# EAGLE design MBC5_1-3_multi (EAGLE 9.6.2)
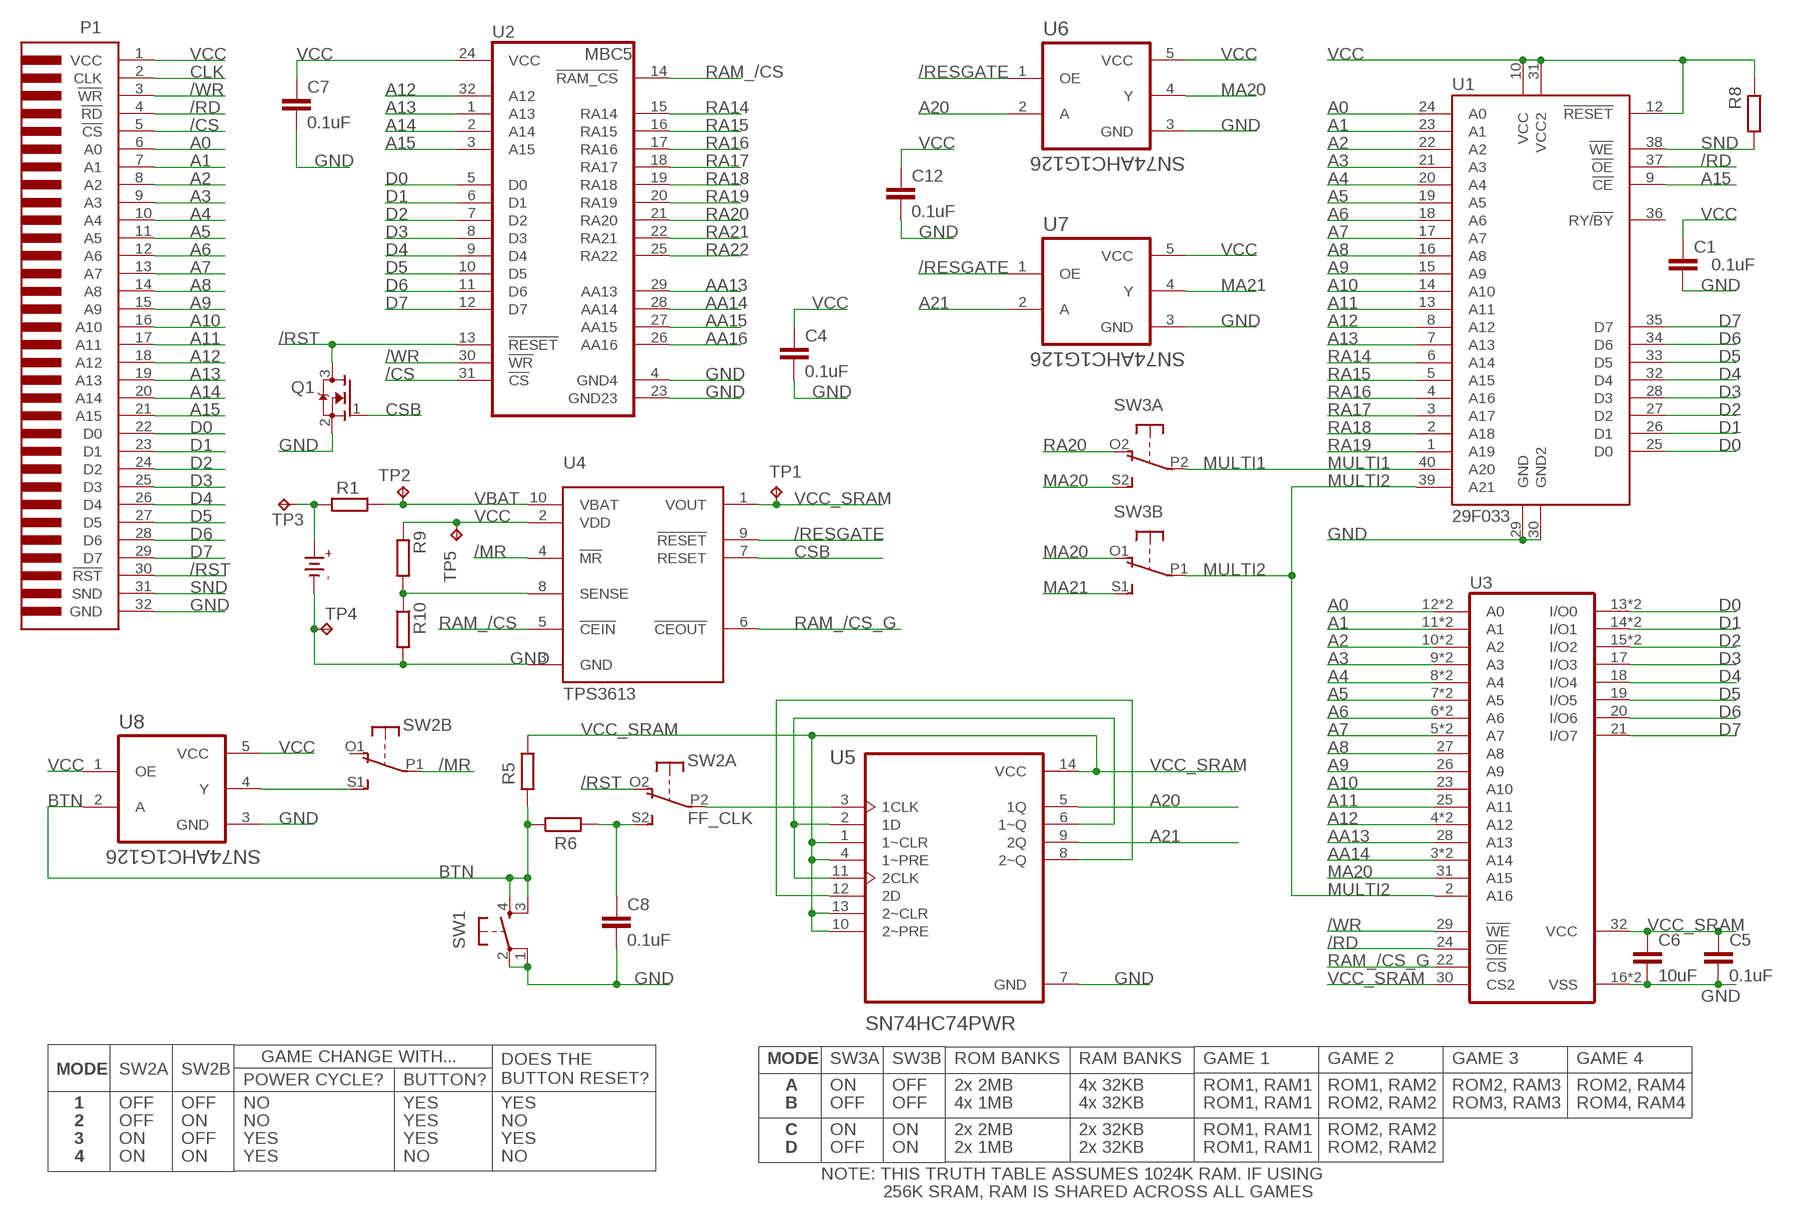
[diagram p0: schematic, sheet 1]

## Parts
C1  0.1uF  C-EUC0603  [C0603]
C4  0.1uF  C-EUC0603  [C0603]
C5  0.1uF  C-EUC0603  [C0603]
C6  10uF  C-EUC0603  [C0603]
C7  0.1uF  C-EUC0603  [C0603]
C8  0.1uF  C-EUC0603  [C0603]
C12  0.1uF  C-EUC0603  [C0603]
P1  GBC_CARTTAB  [GBC_CART_TABBED]
Q1  2N7002  MOSFET-NREFLOW  [SOT23]
R1  RR0603  [R0603]
R5  RR0603  [R0603]
R6  RR0603  [R0603]
R8  RR0603  [R0603]
R9  RR0603  [R0603]
R10  RR0603  [R0603]
SW1  SPST_TACT-KMR2  [KMR2]
SW2  SPDT-2S  [CAS-D20A]
SW3  SPDT-2S  [CAS-D20A]
TP1  TPB1,27  [B1,27]
TP2  TPB1,27  [B1,27]
TP3  TPB1,27  [B1,27]
TP4  TPB1,27  [B1,27]
TP5  TPB1,27  [B1,27]
U1  29F033  [TSOP-40]
U2  MBC5  [QFP-32]
U3  1008_62256_SRAM  [SOP-32L]
U4  TPS3613  [MSOP-10]
U5  SN74HC74PWR  [SOP65P640X120-14N]
U6  SN74AHC1G126  [SC70]
U7  SN74AHC1G126  [SC70]
U8  SN74AHC1G126  [SC70]
U$7  CR2025  [CR2025]

## Nets
/CS: P1.5(!CS) U2.31(!CS)
/MR: SW2.P1(A:P) U4.4(!MR)
/RD: P1.4(!RD) U1.37(!OE) U3.24(!OE)
/RESGATE: U4.9(!RESET) U6.1(OE) U7.1(OE)
/RST: P1.30(!RST) Q1.3(D) SW2.O2(B:O) U2.13(!RESET)
/WR: P1.3(!WR) U2.30(!WR) U3.29(!WE)
A0: P1.6(A0) U1.24(A0) U3.12(A0) U3.L12(A0)
A1: P1.7(A1) U1.23(A1) U3.11(A1) U3.L11(A1)
A2: P1.8(A2) U1.22(A2) U3.10(A2) U3.L10(A2)
A3: P1.9(A3) U1.21(A3) U3.9(A3) U3.L9(A3)
A4: P1.10(A4) U1.20(A4) U3.8(A4) U3.L8(A4)
A5: P1.11(A5) U1.19(A5) U3.7(A5) U3.L7(A5)
A6: P1.12(A6) U1.18(A6) U3.6(A6) U3.L6(A6)
A7: P1.13(A7) U1.17(A7) U3.5(A7) U3.L5(A7)
A8: P1.14(A8) U1.16(A8) U3.27(A8)
A9: P1.15(A9) U1.15(A9) U3.26(A9)
A10: P1.16(A10) U1.14(A10) U3.23(A10)
A11: P1.17(A11) U1.13(A11) U3.25(A11)
A12: P1.18(A12) U1.8(A12) U2.32(A12) U3.4(A12) U3.L4(A12)
A13: P1.19(A13) U1.7(A13) U2.1(A13)
A14: P1.20(A14) U2.2(A14)
A15: P1.21(A15) U1.9(!CE) U2.3(A15)
A20: U5.5(1Q) U6.2(A)
A21: U5.9(2Q) U7.2(A)
AA13: U2.29(AA13) U3.28(A13)
AA14: U2.28(AA14) U3.3(A14) U3.L3(A14)
AA15: U2.27(AA15)
AA16: U2.26(AA16)
BTN: R5.2 R6.1 SW1.3(S1) SW1.4(S) U8.2(A)
CLK: P1.2(CLK)
CSB: Q1.1(G) U4.7(RESET)
D0: P1.22(D0) U1.25(D0) U2.5(D0) U3.13(I/O0) U3.L13(I/O0)
D1: P1.23(D1) U1.26(D1) U2.6(D1) U3.14(I/O1) U3.L14(I/O1)
D2: P1.24(D2) U1.27(D2) U2.7(D2) U3.15(I/O2) U3.L15(I/O2)
D3: P1.25(D3) U1.28(D3) U2.8(D3) U3.17(I/O3)
D4: P1.26(D4) U1.32(D4) U2.9(D4) U3.18(I/O4)
D5: P1.27(D5) U1.33(D5) U2.10(D5) U3.19(I/O5)
D6: P1.28(D6) U1.34(D6) U2.11(D6) U3.20(I/O6)
D7: P1.29(D7) U1.35(D7) U2.12(D7) U3.21(I/O7)
FF_CLK: SW2.P2(B:P) U5.3(1CLK)
GND [GND]: C1.2 C4.2 C5.2 C6.2 C7.2 C8.2 C12.2 P1.32(GND) Q1.2(S) R10.2 SW1.1 SW1.2(P) TP4.TP U1.29(GND) U1.30(GND2) U2.4(GND4) U2.23(GND23) U3.16(VSS) U3.L16(VSS) U4.3(GND) U5.7(GND) U6.3(GND) U7.3(GND) U8.3(GND) U$7.-
MA20: SW3.O1(A:O) SW3.S2(B:S) U3.31(A15) U6.4(Y)
MA21: SW3.S1(A:S) U7.4(Y)
MULTI1: SW3.P2(B:P) U1.40(A20)
MULTI2: SW3.P1(A:P) U1.39(A21) U3.2(A16)
N$1: SW2.S1(A:S) U8.4(Y)
N$2: C8.1 R6.2 SW2.S2(B:S)
N$3 [VCC]: R1.2 TP3.TP U$7.+
N$4: U5.2(1D) U5.6(1~Q) U5.11(2CLK)
N$7: R9.2 R10.1 U4.8(SENSE)
N$14: U5.8(2~Q) U5.12(2D)
RA14: U1.6(A14) U2.15(RA14)
RA15: U1.5(A15) U2.16(RA15)
RA16: U1.4(A16) U2.17(RA16)
RA17: U1.3(A17) U2.18(RA17)
RA18: U1.2(A18) U2.19(RA18)
RA19: U1.1(A19) U2.20(RA19)
RA20: SW3.O2(B:O) U2.21(RA20)
RA21: U2.22(RA21)
RA22: U2.25(RA22)
RAM_/CS: U2.14(!RAM_CS) U4.5(!CEIN)
RAM_/CS_G: U3.22(!CS) U4.6(!CEOUT)
SND: P1.31(SND) R8.2 U1.38(!WE)
VBAT [VCC]: R1.1 TP2.TP U4.10(VBAT)
VCC [VCC]: C1.1 C4.1 C7.1 C12.1 P1.1(VCC) R8.1 R9.1 TP5.TP U1.10(VCC) U1.12(!RESET) U1.31(VCC2) U2.24(VCC) U4.2(VDD) U6.5(VCC) U7.5(VCC) U8.1(OE) U8.5(VCC)
VCC_SRAM [VCC]: C5.1 C6.1 R5.1 TP1.TP U3.30(CS2) U3.32(VCC) U4.1(VOUT) U5.1(1~CLR) U5.4(1~PRE) U5.10(2~PRE) U5.13(2~CLR) U5.14(VCC)
Unconnected: SW2.O1(A:O) U1.36(RY/!BY)

## Notes on the sheet
- GAME CHANGE WITH... | MODE | SW3A | SW3B | ROM BANKS | RAM BANKS | GAME 1 | GAME 2 | GAME 3 | GAME 4
- MODE | SW2A | SW2B
- DOES THE 
  BUTTON RESET?
- POWER CYCLE? | BUTTON?
- A | ON | OFF | 2x 2MB | 4x 32KB | ROM1, RAM1 | ROM1, RAM2 | ROM2, RAM3 | ROM2, RAM4
- 1 | OFF | OFF | NO | YES | YES | B | OFF | OFF | 4x 1MB | 4x 32KB | ROM1, RAM1 | ROM2, RAM2 | ROM3, RAM3 | ROM4, RAM4
- 2 | OFF | ON | NO | YES | NO
- C | ON | ON | 2x 2MB | 2x 32KB | ROM1, RAM1 | ROM2, RAM2
- 3 | ON | OFF | YES | YES | YES
- D | OFF | ON | 2x 1MB | 2x 32KB | ROM1, RAM1 | ROM2, RAM2
- 4 | ON | ON | YES | NO | NO
- NOTE: THIS TRUTH TABLE ASSUMES 1024K RAM. IF USING
- 256K SRAM, RAM IS SHARED ACROSS ALL GAMES

## Library data of the parts
C1 C4-C8 C12 = rcl:C-EU: CAPACITOR, European symbol; SPICEPREFIX: C
P1 = gameboylib:GBC_CART
Q1 = adafruit:MOSFET-N: N-Channel Mosfet 2N7002E - 60V 260mA SOT23 [Digikey: 2N7002ET1GOSTR-ND] - REEL BSH103 - 30V 850mA SOT23 [Digikey: 568-5013-1-ND]
R1 R5 R6 R8-R10 = eagle-ltspice:R: RESISTOR, European symbol; SPICEMODEL: NONE; SPICEPREFIX: R
SW1 = gameboylib:SPST_TACT: SMT 6mm switch, EVQQ2 series http://www.ladyada.net/library/eagle
SW2 SW3 = gameboylib:SPDT-2S
TP1-TP5 = testpad:TP: Test pad
U1 = gameboylib:29F033
U2 = gameboylib:MBC5: MBC5; OC_FARNELL: unknown; OC_NEWARK: unknown
U3 = gameboylib:1008_62256_SRAM
U4 = gameboylib:TPS3613
U5 = SN74HC74PWR:SN74HC74PWR: Check availability <https://pricing.snapeda.com/parts/SN74HC74PWR/Texas%20Instruments/view-part?ref=eda>; AVAILABILITY: In Stock; CHECK_PRICES: https://www.snapeda.com/parts/SN74HC74PWR/Texas+Instruments/view-part/?ref=eda; DESCRIPTION: Dual D-Type Positive-Edge-Triggered Flip-Flops With Clear and Preset; MF: Texas Instruments; MP: SN74HC74PWR; PACKAGE: TSSOP-14 Texas Instruments; PRICE: None; PURCHASE-URL: https://www.snapeda.com/api/url_track_click_mouser/?unipart_id=282074&manufacturer=Texas Instruments&part_name=SN74HC74PWR&search_term=sn74hc74; SNAPEDA_LINK: https://www.snapeda.com/parts/SN74HC74PWR/Texas+Instruments/view-part/?ref=snap
U6-U8 = gameboylib:SN74AHC1G126: Check availability <https://pricing.snapeda.com/parts/SN74AHC1G08DBVR/Texas%20Instruments/view-part?ref=eda>
U$7 = gameboylib:CR2025

## Net classes
1 VCC: width 0.203 mm
2 GND: width 0.203 mm

## Board
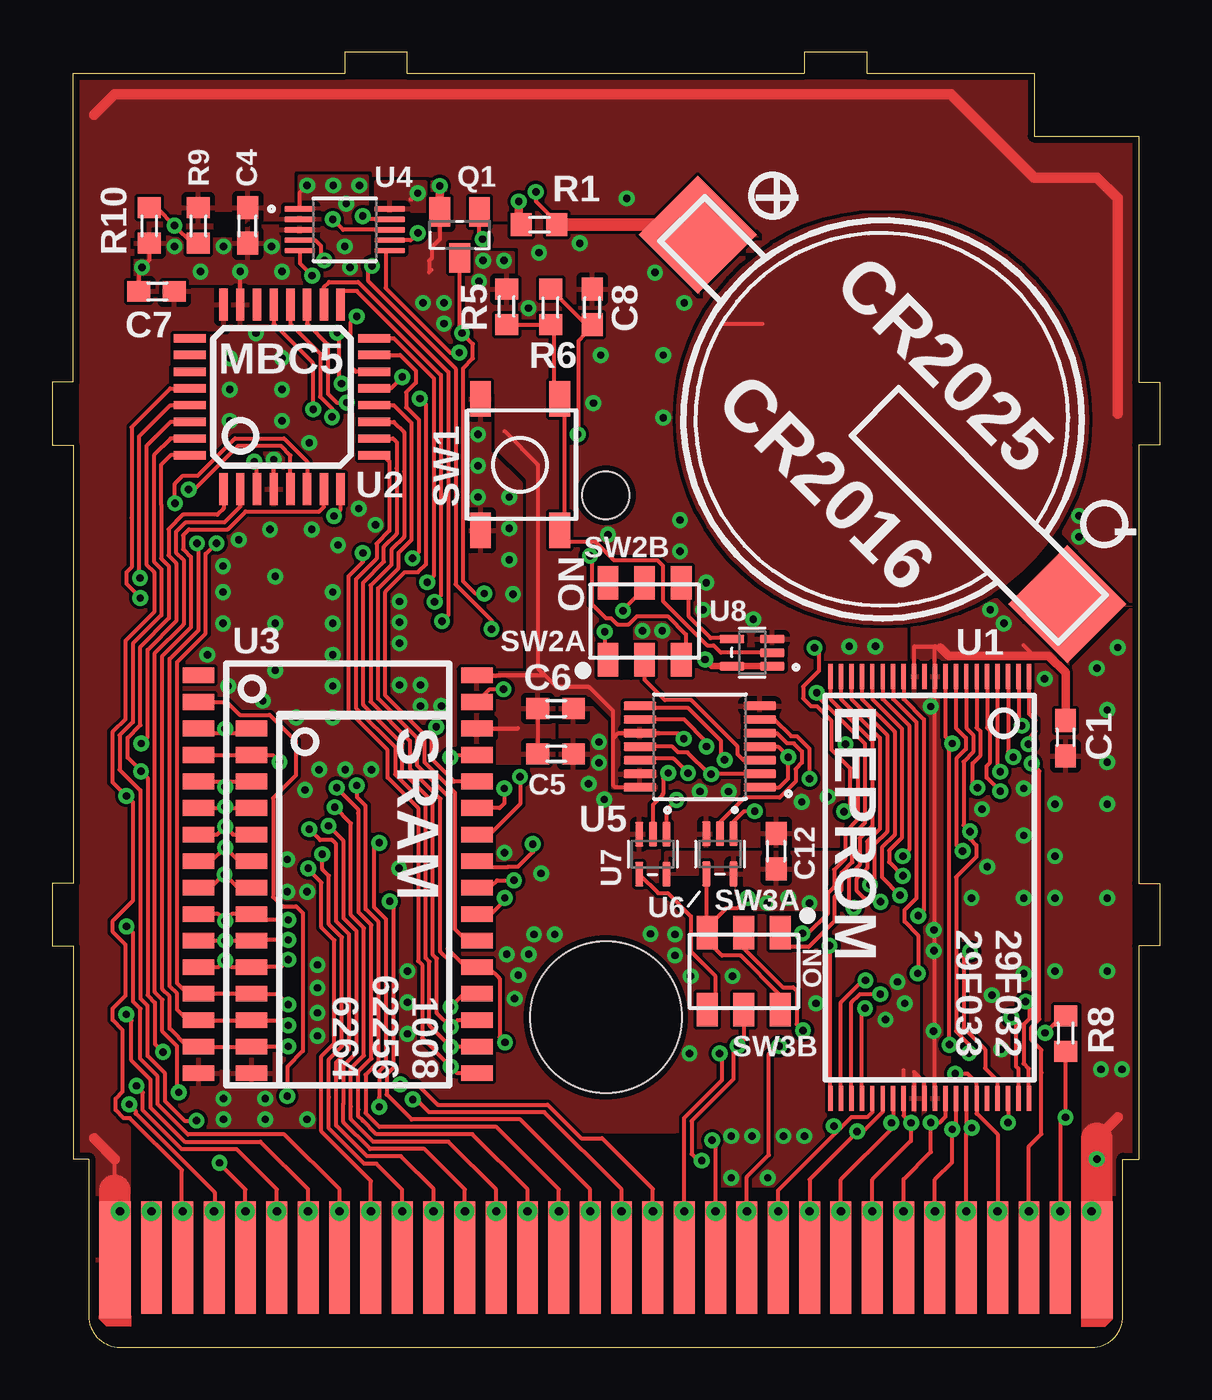
[diagram p1: board, top side]
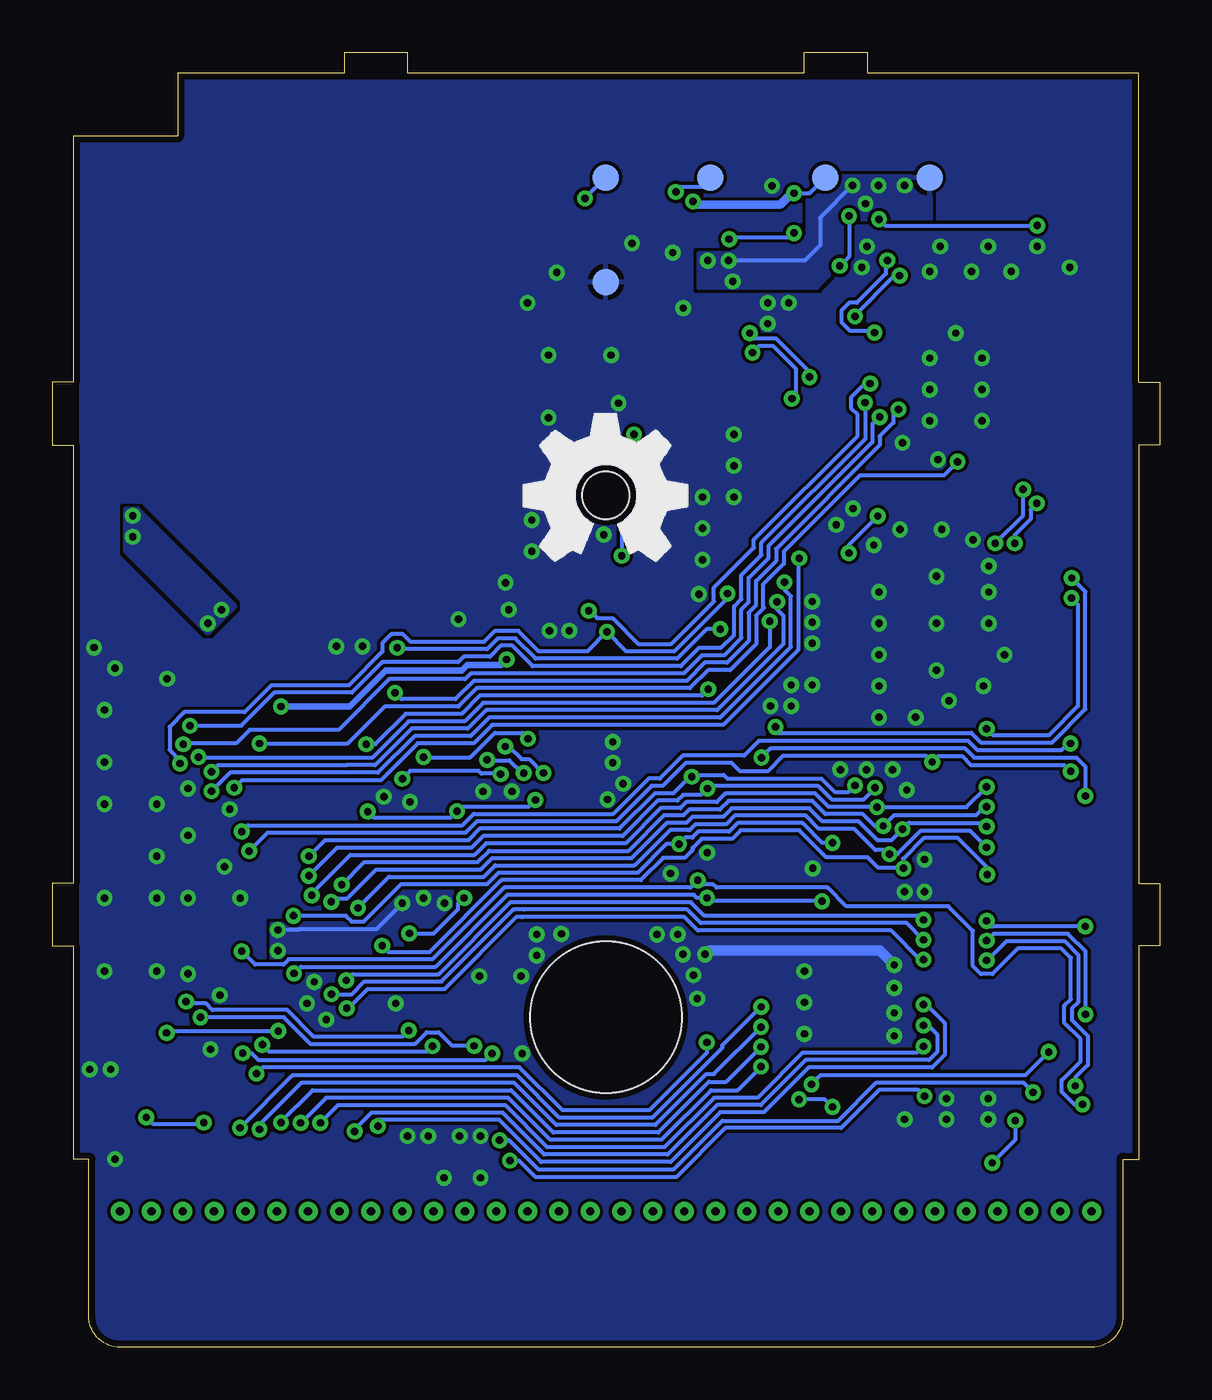
[diagram p2: board, bottom side, seen from below]

Size 53 x 62.01 mm. Coordinates in mm from the lower left corner, seen from the top.
Copper layers (1*16): Top 0.035mm / dielectric 1.5mm / Bottom 0.035mm
Design rules "default *": minimum track width 7mil, minimum drill 13mil, track to track 6mil, track to pad 7mil, pad to pad 7mil, via to via 7mil, smd to smd 5mil, copper to edge 12mil, drill to drill 22mil, minimum pad ring 10mil, minimum via ring 8mil, stop-mask expansion 4mil, vias tented up to drill 14mil, thermal gap 10mil
tKeepout: area -0.8,-1.6 to 55,11.5; area 0,11 to 3,62; area 50,11 to 53,62; area 3,55.1 to 50,62
tRestrict: area 29,6.7 to 34.9,7.6; area 3.9,3.5 to 49.1,7.6; area 11.2,14.4 to 11.8,16.7; area 47.6,0.7 to 50.9,1.2; area 9.3,50.4 to 12.7,50.8; area 7,42.9 to 7.5,48.4; area 9.9,21 to 10.3,29.4; area 10.1,13.5 to 10.4,14.2; area 8,13.4 to 8.6,13.8; area 19.4,28.8 to 19.9,32.5; area 20.8,23.6 to 21.1,29.2; area 20.8,19.8 to 21.1,20.4; area 48.5,4.6 to 49.1,16.4; area 3.9,7 to 4.5,10.6; area 26.1,9.7 to 29.9,10.2; area 11.2,9.9 to 12.8,10.3; area 11.2,18.4 to 11.8,20.7; area 10,17.2 to 10.6,17.9; area 7.8,53.3 to 8.6,54.3; area 39.3,12.4 to 40.8,12.6; area 20.8,13.5 to 21.1,14.1; area 12.5,41.5 to 13.6,41.9; area 14.6,42.9 to 15,45.3; area 9.2,49.1 to 10.4,49.5; area 5.8,47 to 6.2,48.1; area 37.1,32.6 to 46.9,32.8; area 45.3,34.7 to 49,38.9; area 10.9,60.8 to 42.9,61.3; area 0.7,15 to 1.2,47; area 51.8,14.7 to 52.3,46.7; area 27.2,32 to 27.7,34.4
bRestrict: area 51.8,14.7 to 52.3,46.7; area 0.7,15 to 1.2,47; area 10.9,60.8 to 42.9,61.3

### Footprints (pad centres in the part's own frame; a part is rotated, then mirrored left to right if it is on the bottom)
C0603 = smd 1.1 x 1: 1 -0.85,0; 2 0.85,0
GBC_CART_TABBED = smd 1.5 x 5.6: 1 -23.4,-25.01; 32 23.6,-25.01 | smd 1 x 5.4: 2 -21.65,-24.91; 3 -20.15,-24.91; 4 -18.65,-24.91; 5 -17.15,-24.91; 6 -15.65,-24.91; 7 -14.15,-24.91; 8 -12.65,-24.91; 9 -11.15,-24.91; 10 -9.65,-24.91; 11 -8.15,-24.91; 12 -6.65,-24.91; 13 -5.15,-24.91; 14 -3.65,-24.91; 15 -2.15,-24.91; 16 -0.65,-24.91; 17 0.85,-24.91; 18 2.35,-24.91; 19 3.85,-24.91; 20 5.35,-24.91; 21 6.85,-24.91; 22 8.35,-24.91; 23 9.85,-24.91; 24 11.35,-24.91; 25 12.85,-24.91; 26 14.35,-24.91; 27 15.85,-24.91; 28 17.35,-24.91; 29 18.85,-24.91; 30 20.35,-24.91; 31 21.85,-24.91 | drill 0.4: P$1 -21.65,-22.7; P$2 -18.65,-22.7; P$3 -15.65,-22.7; P$4 -12.65,-22.7; P$5 -9.65,-22.7; P$6 -6.65,-22.7; P$7 -3.65,-22.7; P$8 -0.65,-22.7; P$9 2.35,-22.7; P$10 5.35,-22.7; P$11 8.35,-22.7; P$12 11.35,-22.7; P$13 14.35,-22.7; P$14 17.35,-22.7; P$15 20.35,-22.7; P$16 23.35,-22.7; P$17 21.85,-22.7; P$18 18.85,-22.7; P$19 15.85,-22.7; P$20 12.85,-22.7; P$21 9.85,-22.7; P$22 6.85,-22.7; P$23 3.85,-22.7; P$24 0.85,-22.7; P$25 -2.15,-22.7; P$26 -5.15,-22.7; P$27 -8.15,-22.7; P$28 -11.15,-22.7; P$29 -14.15,-22.7; P$30 -17.15,-22.7; P$31 -20.15,-22.7; P$32 -23.15,-22.7 | hole 7.25: 0.1,-13.41 | hole 2.25: 0.1,11.585
SOT23 = smd 1 x 1.4: 1 -0.95,-1.1; 2 0.95,-1.1; 3 0,1.1
R0603 = smd 1 x 1.1: 1 -0.85,0; 2 0.85,0
KMR2 = smd 1.7 x 1: 1 -3.15,1.9; 2 3.15,1.9; 3 -3.15,-1.9; 4 3.15,-1.9
CAS-D20A = smd 1 x 1.6: O1 -1.75,1.85; O2 -1.75,-1.85; P1 0,1.85; P2 0,-1.85; S1 1.75,1.85; S2 1.75,-1.85
B1,27 = smd 1.27 x 1.27: TP 0,0
TSOP-40 = smd 1.2 x 0.21: 1 -10.1,4.75; 2 -10.1,4.25; 3 -10.1,3.75; 4 -10.1,3.25; 5 -10.1,2.75; 6 -10.1,2.25; 7 -10.1,1.75; 8 -10.1,1.25; 9 -10.1,0.75; 10 -10.1,0.25; 11 -10.1,-0.25; 12 -10.1,-0.75; 13 -10.1,-1.25; 14 -10.1,-1.75; 15 -10.1,-2.25; 16 -10.1,-2.75; 17 -10.1,-3.25; 18 -10.1,-3.75; 19 -10.1,-4.25; 20 -10.1,-4.75; 21 10.1,-4.75; 22 10.1,-4.25; 23 10.1,-3.75; 24 10.1,-3.25; 25 10.1,-2.75; 26 10.1,-2.25; 27 10.1,-1.75; 28 10.1,-1.25; 29 10.1,-0.75; 30 10.1,-0.25; 31 10.1,0.25; 32 10.1,0.75; 33 10.1,1.25; 34 10.1,1.75; 35 10.1,2.25; 36 10.1,2.75; 37 10.1,3.25; 38 10.1,3.75; 39 10.1,4.25; 40 10.1,4.75
QFP-32 = smd 0.4 x 1.524: 1 -2.8,-4.415; 2 -2,-4.415; 3 -1.2,-4.415; 4 -0.4,-4.415; 5 0.4,-4.415; 6 1.2,-4.415; 7 2,-4.415; 8 2.8,-4.415; 17 2.8,4.415; 18 2,4.415; 19 1.2,4.415; 20 0.4,4.415; 21 -0.4,4.415; 22 -1.2,4.415; 23 -2,4.415; 24 -2.8,4.415 | smd 1.524 x 0.4: 9 4.415,-2.8; 10 4.415,-2; 11 4.415,-1.2; 12 4.415,-0.4; 13 4.415,0.4; 14 4.415,1.2; 15 4.415,2; 16 4.415,2.8; 25 -4.415,2.8; 26 -4.415,2; 27 -4.415,1.2; 28 -4.415,0.4; 29 -4.415,-0.4; 30 -4.415,-1.2; 31 -4.415,-2; 32 -4.415,-2.8
SOP-32L = smd 0.75 x 1.5: 1 -10.16,-7.997; 2 -8.89,-7.997; 3 -7.62,-5.457; 4 -6.35,-5.457; 5 -5.08,-5.457; 6 -3.81,-5.457; 7 -2.54,-5.457; 8 -1.27,-5.457; 9 0,-5.457; 10 1.27,-5.457; 11 2.54,-5.457; 12 3.81,-5.457; 13 5.08,-5.457; 14 6.35,-5.457; 15 7.62,-5.457; 16 8.89,-5.457; 17 8.89,5.33; 18 7.62,5.33; 19 6.35,5.33; 20 5.08,5.33; 21 3.81,5.33; 22 2.54,5.33; 23 1.27,5.33; 24 0,5.33; 25 -1.27,5.33; 26 -2.54,5.33; 27 -3.81,5.33; 28 -5.08,5.33; 29 -6.35,5.33; 30 -7.62,5.33; 31 -8.89,5.33; 32 -10.16,5.33; L3 -7.62,-7.997; L4 -6.35,-7.997; L5 -5.08,-7.997; L6 -3.81,-7.997; L7 -2.54,-7.997; L8 -1.27,-7.997; L9 0,-7.997; L10 1.27,-7.997; L11 2.54,-7.997; L12 3.81,-7.997; L13 5.08,-7.997; L14 6.35,-7.997; L15 7.62,-7.997; L16 8.89,-7.997
MSOP-10 = smd 1.47 x 0.28: 1 -2.15,1; 2 -2.15,0.5; 3 -2.15,0; 4 -2.15,-0.5; 5 -2.15,-1; 6 2.15,-1; 7 2.15,-0.5; 8 2.15,0; 9 2.15,0.5; 10 2.15,1
SOP65P640X120-14N = smd 1.57 x 0.41: 1 -2.87,1.95; 2 -2.87,1.3; 3 -2.87,0.65; 4 -2.87,0; 5 -2.87,-0.65; 6 -2.87,-1.3; 7 -2.87,-1.95; 8 2.87,-1.95; 9 2.87,-1.3; 10 2.87,-0.65; 11 2.87,0; 12 2.87,0.65; 13 2.87,1.3; 14 2.87,1.95
SC70 = smd 1.19 x 0.4: 1 -0.96,0.65; 2 -0.96,0; 3 -0.96,-0.65; 4 0.96,-0.65; 5 0.96,0.65
CR2025 = smd 4 x 4: + -12,0; - 13,0

### Placement (x,y rotation side)
C1  48.5,29.16 270 top
C4  9.35,53.71 270 top
C5  24.1,28.41 0 top
C6  24.1,30.59 0 top
C7  5,50.56 180 top
C8  25.85,49.81 90 top
C12  34.65,23.76 90 top
P1  26.4,29.21 0 top
Q1  19.5,53.26 180 top
R1  23.3,53.76 0 top
R5  21.75,49.81 270 top
R6  23.85,49.81 90 top
R8  48.5,15.01 270 top
R9  7,53.71 270 top
R10  4.65,53.71 270 top
SW1  22.4,42.26 90 top
SW2  28.35,34.76 0 top
SW3  33.1,18.01 180 top
TP1  11,56.01 0 bottom
TP2  16,56.01 0 bottom
TP3  21.5,56.01 0 bottom
TP4  26.5,51.01 0 bottom
TP5  26.5,56.01 0 bottom
U1  42,22.01 270 top
U2  11,45.51 0 top
U3  15,22.01 270 top
U4  14,53.51 0 top
U5  31,28.76 180 top
U6  31.96,23.63 270 top
U7  28.75,23.61 270 top
U8  33.5,33.26 180 top
U$7  39.39,44.79 315 top

### Tracks (layer width: path | path; a pad name or v marks a point on that pad's centre or on a via)
/CS  (via drill 0.35)
  Top 0.2: 4.86,40.51 4.86,37.62 5.23,37.26 5.23,35.06 3.86,33.69 3.86,29.94 3.23,29.31 3.23,27.65 4.21,26.67 4.21,16.71 4.57,16.35 4.57,13.95 5.4,13.11 5.4,11.78 6.33,10.85 v6.91,10.85
  Top 0.203: U2.31 5.66,43.51 4.86,42.71 4.86,40.51 | P1.5 9.25,7.56 8.01,8.81 v8.01,8.83
  Bottom 0.2: v8.01,8.83 6.91,9.93 v6.91,10.85
/MR  (via drill 0.35)
  Top 0.2: v13.03,52.05 12.86,52.21 12.86,52.75 12.6,53.01 U4.4 | v13.85,46.14 13.72,46.27 13.72,48.51 v13.64,48.59 | v27.32,35.27 27.32,35.33 28.35,36.36 SW2.P1
  Bottom 0.2: v27.32,35.27 27.27,35.27 26.92,34.92 26.18,34.92 24.94,33.68 23.37,33.68 21.33,35.72 21.33,36.37 19.41,38.28 19.41,38.67 14.45,43.63 14.45,44.65 14.75,44.96 14.75,45.5 14.12,46.13 v13.85,46.13 v13.85,46.14 | v13.03,52.05 13.1,51.98 13.1,51.4 14.48,50.02 14.85,50.02 15.23,49.63 15.23,49.09 14.83,48.69 13.74,48.69 v13.64,48.59
/RD  (via drill 0.35)
  Top 0.2: U3.24 20.95,22.01 21.3,22.36 v22.1,22.36 | P1.4 7.78,4.03 7.78,7.41 3.99,11.2 3.99,11.33 v3.69,11.63 | v43.92,18.96 43.62,18.66 43.62,15.29 44.65,14.26 44.65,13.36 45.25,12.76 U1.37
  Bottom 0.2: 22.05,22.41 v22.1,22.36 22.45,22.01 31.36,22.01 34.8,18.57 41.68,18.57 41.93,18.33 43.29,18.33 v43.92,18.96 | v3.69,11.63 4.07,11.63 4.69,12.24 4.69,12.79 3.78,13.69 3.78,14.76 4.55,15.53 4.55,16.36 4.25,16.67 4.25,18.65 4.69,19.09 6.78,19.09 8,17.87 8.55,17.87 8.93,18.25 8.93,19.94 10.11,21.12 14.99,21.12
  Bottom 0.203: 14.99,21.12 15.88,22.01 21.2,22.01 21.38,22.19 21.93,22.19 v22.1,22.36
/RESGATE  (via drill 0.35)
  Top 0.2: U4.9 15.02,54.01 v14.86,54.17 | v15.31,51.78 15.11,51.58 15.11,51.07 19.31,46.87 19.31,36.52 21.03,34.81 v21.03,34.39 | v37.9,25.65 38.2,25.95 38.2,27.72 37.31,28.61 37.31,29.99 36.61,30.69 36.32,30.69 35.94,31.07 35.94,31.64 36.69,32.39 36.69,33.29 v36.49,33.49 | v29.88,26.21 29.4,25.73 U7.1 | 33.1,25.67 32.61,25.18 U6.1
  Top 0.203: v33.62,25.67 33.1,25.67
  Bottom 0.2: v14.86,54.17 14.86,52.22 v15.31,51.78 | v21.03,34.39 21.67,34.39 23.08,32.97 29.86,32.97 30.83,33.94 31.67,33.94 32.19,33.42 36.49,33.42 v36.49,33.49 | v33.62,25.67 33.95,25.35 37.59,25.35 v37.9,25.65
  Bottom 0.203: v33.62,25.67 33.4,25.89 30.19,25.89 v29.88,26.21
/RST  (via drill 0.35)
  Top 0.2: v19.62,48.56 19.66,48.51 | v16.75,46.46 16.2,45.91 U2.13 | v19.62,48.56 19.5,48.68 Q1.3 | v20.68,36.09 20.24,36.09 19.66,36.67 19.66,46.88 20.14,47.35 20.14,48.04 v19.62,48.56 | v46.89,27.95 47.25,27.59 47.25,15.71 46.87,15.33 46.87,14.72 47.35,14.24 47.35,13.15
  Top 0.203: 47.35,13.15 47.35,10.21 46.75,9.61 P1.30 | v26.45,34.26 26.45,33.06 SW2.O2
  Bottom 0.2: v19.62,48.56 19.37,48.31 18.37,48.31 16.75,46.69 v16.75,46.46 | v20.68,36.09 20.68,35.88 23.23,33.33 25.52,33.33 v26.45,34.26 27.39,33.32 29.71,33.32 30.69,34.3 31.81,34.3 32.33,33.78 35.85,33.78 36.22,34.15 36.76,34.15 37.19,33.72 37.19,33.31 38.81,31.69 42.52,31.69 43.79,30.42 46.68,30.42 47.39,29.71 47.39,28.6 46.89,28.1 v46.89,27.95
/WR  (via drill 0.35)
  Top 0.2: v19.05,28.24 19.18,28.36 U3.29 | 4.51,39.51 4.51,37.48 4.88,37.11 4.88,35.2 3.51,33.83 3.51,30.08 2.88,29.45 2.88,27.08 v3.55,26.4 3.86,26.09 3.86,21.38 2.9,20.42 2.9,19.88 3.51,19.27 3.51,16.84 2.89,16.22 2.89,15.67 3.37,15.19 3.37,12.24 3.03,11.9 3.03,11.36 3.42,10.97 3.71,10.97 6.2,8.49 6.2,4.05
  Top 0.203: U2.30 5.66,44.31 4.51,43.16 4.51,39.51 | P1.3 6.2,4.05
  Bottom 0.2: 19.05,28.19 v19.05,28.24 18.6,28.69 9.33,28.69 8.88,28.23 3.98,28.23 3.55,27.81 v3.55,26.4
A0  (via drill 0.35)
  Top 0.2: P1.6 10.75,7.56 8.82,9.49 6.19,9.49 4.34,11.34 4.34,12.2 v4.03,12.51 | v11.3,18.56 10.95,18.21 9.55,18.21 U3.12 8.6,18.2 v8.28,18.53 7.95,18.2 U3.L12 | v38.91,16.23 38.75,16.08 U1.24
  Bottom 0.2: 30.5,20.6 30.78,20.6 34.22,17.16 37.91,17.16 38.83,16.23 v38.91,16.23 | v8.28,18.53 8.23,18.53 7.31,19.45 4.55,19.45 3.9,18.79 3.9,16.52 4.2,16.22 4.2,15.67 3.43,14.9 3.43,13.52 4.03,12.91 v4.03,12.51
  Bottom 0.203: v11.3,18.56 11.45,18.56 12.84,19.95 22.1,19.95 22.75,20.6 30.5,20.6 30.53,20.6
A1  (via drill 0.35)
  Top 0.2: v11.3,19.51 9.83,19.51 U3.11 v8.28,19.47 U3.L11 | P1.7 12.25,7.56 9.97,9.84 6.34,9.84 4.7,11.49 4.7,12.82 3.79,13.73 3.79,15.64 3.54,15.88 v3.54,15.94 | v39.63,16.91 38.65,16.91 38.25,16.51 U1.23
  Bottom 0.2: 30.43,20.96 30.9,20.96 | 30.9,20.96 30.91,20.95 30.92,20.95 | 30.9,20.96 30.92,20.96 34.37,17.51 38.06,17.51 38.66,16.91 v39.63,16.91 | v3.54,15.94 3.54,18.96 4.38,19.8 7.95,19.8 v8.28,19.47
  Bottom 0.203: v11.3,19.51 12.1,20.31 21.95,20.31 22.6,20.96 30.43,20.96
A2  (via drill 0.35)
  Top 0.2: v11.3,20.46 9.82,20.46 U3.10 8.6,20.74 v8.28,20.42 7.95,20.74 U3.L10 | P1.8 13.75,7.56 11.12,10.19 6.49,10.19 5.05,11.64 5.05,12.97 4.21,13.8 4.21,16.21 3.86,16.56 3.86,19.85 v3.56,20.15 | v38.93,17.57 38.81,17.57 37.75,16.51 U1.22
  Bottom 0.2: v11.3,20.46 11.53,20.69 21.81,20.69 22.43,21.31 31.07,21.31 34.51,17.87 38.63,17.87 v38.93,17.57 | v3.56,20.15 8.01,20.15 v8.28,20.42
A3  (via drill 0.35)
  Top 0.2: P1.9 15.25,7.97 12.88,10.33 12.88,13.93 13.51,14.55 13.51,19.49 12.89,20.11 12.89,22.25 12.25,22.89 v12.25,22.94 | U3.L9 7.58,22.01 8.2,22.64 v8.25,22.64 8.88,22.01 U3.9 | v37.2,19.23 37.25,19.18 U1.21
  Bottom 0.2: 13.47,22.95 13.98,23.46 15.95,23.46 17.24,24.75 20.05,24.75 20.45,24.34 21.92,24.34 22.34,23.92 22.34,23.82 22.73,23.44 23.76,23.44 24.83,22.37 31.5,22.37 34.94,18.93 36.9,18.93 v37.2,19.23 | 8.25,22.76 v8.25,22.64 8.25,22.98 9.65,24.38 11.28,24.38 12.27,23.39 12.27,22.95 | 12.27,22.95 12.3,22.95
  Bottom 0.203: v12.25,22.94 12.27,22.95 | 12.3,22.95 13.47,22.95
A4  (via drill 0.35)
  Top 0.2: P1.10 16.75,7.55 15.51,8.79 14.93,8.79 13.24,10.48 13.24,11.97 13.24,13.79 13.86,14.41 13.86,19.63 13.24,20.25 13.24,22.57 12.93,22.89 v12.93,23.61 | U3.8 8.93,23.28 v8.28,23.94 7.62,23.28 U3.L8 | v38.37,21.04 38.13,21.28 38.13,22.57 38.65,23.09 38.65,24.37 39.26,24.97 39.26,29.04 37.25,31.05 U1.20
  Bottom 0.2: v8.28,23.94 9.07,24.74 11.43,24.74 12.55,23.61 v12.93,23.61 13.12,23.81 13.6,23.81 14.62,24.83 16.31,24.83 16.94,25.46 20.34,25.46 20.75,25.05 22.21,25.05 22.5,24.75 22.53,24.75 22.54,24.76 23.43,24.76 25.12,23.07 31.8,23.07 32.34,22.52 36.89,22.52 v38.37,21.04
A5  (via drill 0.35)
  Top 0.2: P1.11 18.25,7.59 16.69,9.14 15.07,9.14 13.59,10.63 13.59,11.82 13.59,13.64 14.21,14.26 14.21,19.78 13.59,20.4 13.59,24.1 13.4,24.29 12.82,24.29 v12.3,24.81 | U3.7 8.66,24.55 v8.28,24.94 7.89,24.55 U3.L7 | v39.64,21.33 39.48,21.49 38.87,21.49 38.48,21.88 38.48,22.42 39,22.94 39,24.22 39.61,24.83 39.61,29.18 37.75,31.04 U1.19
  Bottom 0.2: v8.28,24.94 8.45,25.11 12,25.11 v12.3,24.81 12.82,24.29 13.5,24.29 14.4,25.18 16.14,25.18 16.77,25.81 20.48,25.81 20.89,25.4 22.36,25.4 22.64,25.11 23.58,25.11 25.27,23.42 31.94,23.42 32.49,22.88 37.49,22.88 38.87,21.49 39.48,21.49 v39.64,21.33
A6  (via drill 0.35)
  Top 0.2: P1.12 19.75,7.56 17.81,9.5 15.22,9.5 13.94,10.77 13.94,11.68 13.94,13.49 14.56,14.12 14.56,19.92 13.94,20.55 13.94,24.24 v13.22,24.96 | v8.28,25.89 8.28,25.82 | 8.28,25.82 U3.6 | U3.L6 8.28,25.82 | v39.14,22.15 39.36,22.36 39.36,24.07 39.96,24.68 39.96,29.33 38.25,31.04 U1.18
  Bottom 0.2: v8.28,25.89 8.38,25.89 8.78,25.49 12.7,25.49 v13.22,24.96 13.62,24.96 14.2,25.54 15.99,25.54 16.62,26.16 20.63,26.16 21.04,25.75 22.51,25.75 22.79,25.47 23.72,25.47 25.41,23.78 32.09,23.78 32.64,23.23 38.06,23.23 v39.14,22.15
A7  (via drill 0.35)
  Top 0.2: 8.43,27.09 8.28,26.94 v8.28,26.84 | 8.43,27.09 U3.5 | v13.53,25.86 14.29,25.09 14.29,20.69 14.92,20.07 14.92,13.97 14.29,13.35 14.29,11.53 14.29,10.92 15.36,9.85 18.96,9.85 21.25,7.56 P1.13 | U3.L5 8.43,27.09 | v40.58,21.64 39.71,22.51 39.71,23.93 40.31,24.54 40.31,29.47 38.75,31.04 U1.17
  Bottom 0.2: v13.53,25.86 9.25,25.86 v8.28,26.84 | v13.53,25.86 13.59,25.79 | v13.53,25.86 13.55,25.89 15.85,25.89 16.47,26.51 20.77,26.51 21.18,26.1 22.65,26.1 22.94,25.82 23.87,25.82 25.56,24.13 32.23,24.13 32.78,23.58 38.73,23.58 40.58,21.73 v40.58,21.64
A8  (via drill 0.35)
  Top 0.2: P1.14 22.75,7.56 20.11,10.2 15.51,10.2 14.86,10.86 14.85,10.86 14.65,11.06 14.65,11.39 14.65,13.2 15.27,13.82 15.27,20.21 14.65,20.84 14.65,25.56 14.65,25.76 v13.62,26.79 | 20.55,26.04 U3.27 21.41,25.82 21.64,26.05 v21.64,26.76 | v40.72,22.58 40.06,23.23 40.06,23.78 40.67,24.39 40.67,29.62 39.25,31.04 U1.16
  Bottom 0.2: 15.7,26.24 16.32,26.87 21.53,26.87 v21.64,26.76 21.94,26.46 22.8,26.46 23.08,26.17 24.02,26.17 25.7,24.48 32.38,24.48 32.93,23.93 39.36,23.93 v40.72,22.58
  Bottom 0.203: 15.7,26.24 14.16,26.24 v13.62,26.79
A9  (via drill 0.35)
  Top 0.2: P1.15 24.25,7.56 21.26,10.55 15.66,10.55 15,11.21 | U3.26 20.94,24.55 22.39,26 v22.39,27.32 | 15,11.24 15,13.06 15.62,13.68 15.62,20.36 15,20.98 15,25.94 | v40.72,23.51 41.02,23.81 41.02,29.77 39.75,31.04 U1.15
  Top 0.203: 15,25.64 15,25.94 14.99,25.94 14.58,26.35 v14.58,26.9 | 15,11.21 15,11.24
  Bottom 0.2: 16.17,27.22 20.67,27.22 20.86,27.42 22.3,27.42 v22.39,27.32 22.46,27.32 23.26,26.52 24.16,26.52 25.85,24.83 32.53,24.83 33.07,24.29 39.94,24.29 v40.72,23.51
  Bottom 0.203: 16.17,27.22 15.55,26.6 14.88,26.6 v14.58,26.9
A10  (via drill 0.35)
  Top 0.2: P1.16 25.75,7.56 22.41,10.91 17.2,10.91 16,12.11 16,13.06 16.34,13.39 16.34,21.18 v16.16,21.35 | U3.23 20.09,20.75 21.02,20.75 | v41.42,17.9 41.45,17.92 41.45,19.73 40.79,20.39 40.79,20.93 41.37,21.51 41.37,29.91 40.25,31.04 U1.14
  Top 0.203: v21.66,21.52 21.66,21.4 21.02,20.75
  Bottom 0.2: v21.66,21.52 22.14,21.52 22.29,21.66 31.21,21.66 34.65,18.22 41.1,18.22 v41.42,17.9
  Bottom 0.203: v16.16,21.35 16.2,21.4 21.55,21.4 v21.66,21.52
A11  (via drill 0.35)
  Top 0.2: P1.17 27.25,7.56 23.55,11.26 18.04,11.26 17.39,11.9 17.31,11.82 v17.26,11.87 | v15.66,24.15 15.4,24.15 15.4,21.08 15.97,20.51 15.97,13.53 15.65,13.21 15.65,11.96 15.66,11.96 v15.66,11.51 | 23,23.99 v23,24.09 23,23.72 22.3,23.02 21.83,23.02 21.82,23.01 20.6,23.01 U3.25 | v41.45,20.66 41.73,20.94 41.73,30.06 40.75,31.04 U1.13
  Top 0.203: 20.58,23.03 U3.25
  Bottom 0.2: v15.66,11.51 16.01,11.87 v17.26,11.87 | v15.66,24.15 16.13,24.15 17.08,25.1 20.19,25.1 20.6,24.69 22.07,24.69 22.36,24.4 22.69,24.4 | 22.68,24.41 22.69,24.4 | 22.69,24.4 v23,24.09 23.6,24.09 24.98,22.72 31.65,22.72 32.2,22.17 36.31,22.17 38.1,20.39 38.67,20.39 38.95,20.66 v41.45,20.66
A12  (via drill 0.35)
  Top 0.2: P1.18 28.75,7.59 26.32,10.01 25.32,10.01 23.72,11.61 18.46,11.61 17.48,12.59 v16.66,12.59 | v10.88,28.03 10.54,28.36 U3.4 U3.L4 | 5.22,41.01 5.22,40.36 5.21,40.36 5.21,37.77 5.58,37.4 5.58,34.91 4.21,33.54 4.21,29.79 3.61,29.18 3.61,28.24 4.25,27.6 v4.25,27.58 4.57,27.26 4.57,16.85 4.92,16.5 4.92,14.52 v5.3,14.14 | v43.58,23.76 43.27,24.06 43.27,28.18 43.73,28.64 43.73,29.18 43.25,29.66 U1.8
  Top 0.203: U2.32 5.67,42.71 5.22,42.26 5.22,41.01
  Bottom 0.2: v16.66,12.59 16.21,13.04 6.4,13.04 v5.3,14.14 | v4.25,27.58 4.55,27.88 9.03,27.88 9.45,28.3 10.6,28.3 v10.88,28.03 11.18,28.33 18,28.33 18.75,27.58 20.08,27.58 20.48,27.98 22.67,27.98 23.77,26.88 | 26,25.19 32.67,25.19 33.22,24.64 42.69,24.64 v43.58,23.76
  Bottom 0.203: v10.88,28.03 10.88,27.96 | 23.77,26.88 24.31,26.88 26,25.19
A13  (via drill 0.35)
  Top 0.2: P1.19 30.25,10.98 32.06,12.79 32.06,13.95 v31.94,14.07 31.81,14.07 31.81,14.19 | U2.1 8.2,40.16 7.9,39.86 6.25,39.86 5.57,39.18 5.57,37.92 5.93,37.55 5.93,34.76 4.57,33.39 4.57,29.22 v4.26,28.91 | v43.88,14.09 43.88,14.51 43.26,15.13 43.26,22.52 44.23,23.49 44.23,24.03 43.93,24.33 v43.93,24.69 43.63,25 43.63,28.04 44.08,28.49 44.08,29.33 43.75,29.66 U1.7
  Bottom 0.2: v4.26,28.91 4.39,28.91 4.69,28.61 8.73,28.61 9.16,29.04 19.17,29.04 19.88,28.33 22.81,28.33 23.91,27.23 24.45,27.23 26.15,25.54 32.82,25.54 33.36,24.99 43.63,24.99 v43.93,24.69 | v31.94,14.07 32.25,13.76 43.15,13.76 43.47,14.09 v43.88,14.09
A14  (via drill 0.35)
  Top 0.178: 6.4,39.51 6.41,39.52
  Top 0.2: U2.2 9,40.26 8.25,39.51 6.4,39.51 5.92,39.03 5.92,38.06 6.29,37.69 6.29,34.62 4.92,33.25 4.92,17 5.27,16.64 5.27,15.12 5.97,14.41 5.97,12.29 v6.06,12.21
  Top 0.203: P1.20 31.75,9.75 v31.59,9.92
  Bottom 0.2: 13.55,12.68 6.53,12.68 v6.06,12.21
  Bottom 0.203: 13.55,12.68 15.38,10.85 20.93,10.85 23.26,8.52 29.74,8.52 31.13,9.92 v31.59,9.92
A15  (via drill 0.35)
  Top 0.2: P1.21 33.25,8.16 34.3,9.21 34.3,14.06 34.66,14.42 v34.8,14.42 | v42.94,14.49 42.91,14.52 42.91,28.74 v43.08,28.91 42.75,29.24 U1.9
  Top 0.203: U2.3 9.8,42.27 v9.67,42.4
  Bottom 0.2: 13.15,41.74 14.35,41.74 17.98,38.1 17.98,37.52 18.96,36.55 18.96,35.42 18.94,35.4 19.31,35.03 19.31,33.67 20.55,32.43 21.61,32.43 22.48,31.56 32.67,31.56 33.56,30.68 37.09,30.68 38.85,28.92 43.06,28.92 v43.08,28.91 43.06,28.93 | v34.8,14.42 35.05,14.16 42.62,14.16 v42.94,14.49
  Bottom 0.203: v9.67,42.4 10.32,41.74 13.15,41.74
A20
  Top 0.2: 33.89,29.39 34.7,29.39 35.17,28.92 35.5,28.92 35.88,28.53 35.88,28.51 35.88,27.99 35.58,27.69 35.58,27.09 34.82,26.33 34.82,26.32 33.15,26.32 31.96,25.13 U6.2
  Top 0.203: 33.85,29.39 U5.5 33.89,29.39
A21  (via drill 0.35)
  Top 0.2: 29.24,26.53 29.24,26.5 29.22,26.48 29.22,26.44 28.75,25.97 U7.2
  Top 0.203: v29.49,27.5 29.24,27.25 29.24,26.53 | U5.9 30.25,30.06 31.31,28.99 v31.31,28.77
  Bottom 0.203: v31.31,28.77 31.14,28.77 30.54,28.17 30.18,28.17 29.51,27.5 v29.49,27.5
AA13  (via drill 0.35)
  Top 0.2: U3.28 19.24,27.09 18.17,28.16 18.17,29.5 v18.38,29.71
  Top 0.203: v4.2,36.84 4.15,36.89 4.15,43.61 5.65,45.11 U2.29
  Bottom 0.2: v18.38,29.71 18.38,29.42 9.01,29.42 8.56,28.96 5.14,28.96 3.55,30.55 3.55,36.19 v4.2,36.84
AA14  (via drill 0.35)
  Top 0.2: 3.79,44.06 3.79,39.72 3.8,39.71 3.8,37.36 3.54,37.11 3.54,36.56 4.21,35.89 v4.21,35.87 | v8.28,29.62 8.28,29.38
  Top 0.203: 3.79,44.06 5.65,45.91 U2.28 | U3.3 9.29,29.38 8.28,29.38 7.25,29.38 U3.L3
  Bottom 0.2: v4.21,35.87 3.9,35.56 3.9,30.7 5.29,29.31 7.97,29.31 v8.28,29.62
  Bottom 0.203: v4.21,35.87 4.25,35.91
BTN
  Top 0.2: 34.36,33.36 U8.2 | 31.65,33.61 31.35,33.61 29.23,35.73 29.23,37.42 28.96,37.69 26.88,37.69 26.02,38.55 24.61,38.55 24.3,38.86 SW1.3 24.5,39.31 24.5,45.21 SW1.4 24,45.71 24,48.81 R6.1 R5.2
  Top 0.203: U8.2 32,33.26 31.65,33.61
CSB  (via drill 0.35)
  Top 0.2: 20.45,53.21 Q1.1
  Top 0.203: 20.45,53.21 v20.6,53.06 | v17.5,53.35 17.16,53.01 U4.7
  Bottom 0.203: v20.6,53.06 20.51,53.15 17.7,53.15 v17.5,53.35
D0  (via drill 0.35)
  Top 0.2: v11.3,16.41 10.78,16.93 U3.13 U3.L13 6.48,16.93 5.97,17.44 5.97,32.81 7.34,34.18 7.34,37.98 v7.86,38.5 | 34.75,5.05 P1.22 34.75,7.51 37.45,10.21 | U2.5 11.4,42.71 10.95,43.16 8.89,43.16 6.8,41.08 v6.53,41.08 | 37.45,10.21 38.25,11.01 39,11.01 39.25,11.26 U1.25 | v37.41,10.59 37.45,10.55 37.45,10.21
  Top 0.203: U3.13 8.95,16.93
  Bottom 0.2: v11.3,16.41 11.17,16.41 10.29,15.53 10.29,13.99 10.88,13.4 16.78,13.4 18.94,11.25 21.03,11.25 23.4,8.88 29.6,8.88 31.61,10.9 37.41,10.9 v37.41,10.59 | v6.53,41.08 6.53,39.83 v7.86,38.5
D1  (via drill 0.35)
  Top 0.2: v11.3,15.41 11.05,15.66 U3.14 U3.L14 | 36.25,5.32 P1.23 36.25,8.03 38.53,10.31 v38.53,10.34 38.82,10.34 39.75,11.26 U1.26 | v5.87,40.41 5.87,41.36 6.25,41.73 6.96,41.73 8.74,43.51 11.1,43.51 12.2,42.41 U2.6 | v6.93,38.5 6.99,38.43 6.99,34.33 5.62,32.96 5.62,17.29 5.97,16.94 5.97,16.16 6.47,15.66 U3.L14 | 6.5,15.66 U3.L14
  Top 0.203: U3.14 9.09,15.66
  Bottom 0.2: v11.3,15.41 11.07,15.41 10.64,14.98 10.64,14.14 11.03,13.75 16.93,13.75 19.08,11.6 21.18,11.6 23.55,9.23 29.45,9.23 31.47,11.25 37.71,11.25 38.53,10.44 v38.53,10.34 | v6.93,38.5 6.93,38.9 6.17,39.65 6.17,40.11 v5.87,40.41
D2  (via drill 0.35)
  Top 0.2: v11.3,14.41 11.28,14.39 U3.15 U3.L15 | U2.7 13,40.24 12.78,40.02 9.26,40.02 8.39,39.16 6.54,39.16 6.27,38.88 6.27,38.21 6.64,37.84 6.64,34.47 5.27,33.1 5.27,17.14 5.62,16.79 5.62,15.26 6.5,14.39 U3.L15 | P1.24 37.75,8.03 40.16,10.45 v40.16,10.75 40.25,10.83 U1.27 | U3.L15 6.45,14.39
  Top 0.203: U3.15 8.92,14.39
  Bottom 0.2: v11.3,14.41 11.6,14.11 17.07,14.11 19.23,11.95 21.32,11.95 23.7,9.58 29.3,9.58 31.32,11.6 39.31,11.6 v40.16,10.75
D3  (via drill 0.35)
  Top 0.2: U3.17 19.39,13.12 v19.07,13.44 17.7,14.81 17.7,18.31 17.51,18.5 17.51,25.83 16.06,27.28 16.06,28.6 14.18,30.47 14.18,36.92 14.87,37.6 v14.87,38.03 | 13.71,41 U2.8 13.8,40.11 v13.49,39.8 | P1.25 39.25,8.03 41.1,9.88 41.1,10.73 v41.11,10.75 41.09,10.75 40.75,11.09 U1.28
  Bottom 0.2: v19.07,13.44 20.2,12.31 21.47,12.31 23.84,9.94 29.16,9.94 31.18,11.95 39.89,11.95 41.09,10.75 v41.11,10.75 | v14.87,38.03 14.87,38.42 v13.49,39.8
D4  (via drill 0.35)
  Top 0.2: U3.18 v19.08,14.39 | v19.08,14.39 v19.07,14.39 | 15.94,42.71 U2.9 15.84,42.71 16.14,42.41 16.14,42.24 16.14,39.09 15.52,38.48 15.52,37.76 14.54,36.77 14.54,30.62 16.41,28.75 16.41,27.43 17.87,25.97 17.87,18.64 18.06,18.46 18.06,15.41 v19.08,14.39 | P1.26 40.75,8.04 42.05,9.35 v42.05,10.75 42.47,10.75 42.75,11.04
  Top 0.203: U1.32 42.75,11.04 42.47,10.75 v42.05,10.75
  Bottom 0.2: v19.07,14.39 20.75,12.71 21.57,12.71 23.99,10.29 29.01,10.29 31.03,12.31 40.53,12.31 42.05,10.79 v42.05,10.75
D5  (via drill 0.35)
  Top 0.2: U3.19 19.4,15.66 v19.07,15.34 18.41,16 18.41,18.6 18.22,18.79 18.22,26.11 16.76,27.57 16.76,28.89 14.89,30.77 14.89,36.62 15.88,37.61 15.88,38.34 16.49,38.95 16.49,42.09 16.49,42.1 16.49,43.34 16.32,43.51 U2.10 | P1.27 42.25,8.03 43.08,8.86 v43.08,10.43 43.25,10.61 U1.33
  Bottom 0.2: v19.07,15.34 21.32,13.09 21.69,13.09 24.13,10.64 28.87,10.64 30.88,12.66 41.08,12.66 43.19,10.55 v43.08,10.43
D6  (via drill 0.35)
  Top 0.2: U3.20 19.7,16.93 v19.06,16.3 19.06,18.45 18.58,18.94 18.58,26.26 17.12,27.72 17.12,29.04 15.24,30.91 15.24,36.48 16.23,37.47 16.23,38.19 16.84,38.8 16.84,41.95 16.84,43.82 16.35,44.31 U2.11 | v44.01,10.51 43.75,10.25 P1.28 | v44.01,10.51 | v44.01,10.51 43.75,10.76 U1.34
  Bottom 0.2: v19.06,16.3 19.09,16.3 20.94,14.45 20.94,14.33 24.28,10.99 28.72,10.99 30.74,13.01 41.51,13.01 v44.01,10.51
D7  (via drill 0.35)
  Top 0.2: 45.23,4.92 45.25,4.9 P1.29 45.25,10.2 44.25,11.2 U1.35 | v21.67,14.6 21.42,14.85 21.42,17.65 20.87,18.2 U3.21 19.81,18.2 18.93,19.09 18.93,26.41 17.47,27.87 17.47,29.18 15.59,31.06 15.59,36.33 16.58,37.32 16.58,38.04 17.2,38.66 17.2,41.8 17.2,44.26 16.35,45.11 U2.12 | 44.25,12.65 43.79,13.11 v43.22,13.11
  Top 0.203: U1.35 44.25,12.65
  Bottom 0.2: v21.67,14.6 21.67,14.1 24.43,11.35 28.57,11.35 30.64,13.41 42.92,13.41 v43.22,13.11
FF_CLK
  Top 0.203: U5.3 33.08,28.11 32.8,28.39 32.8,28.76 30.57,30.99 29.32,30.99 28.35,31.96 SW2.P2 28.35,32.69
GND  (via drill 0.35)
  Top 0.203: 40.75,12.8 40.75,13.26 | U2.4 v10.6,42.5 | C7.2 4.15,51.56 v4.3,51.71 4.65,52.06 R10.2 | 9,52.41 8.95,52.46 C4.2 | 18.15,51.59 18.04,51.47 18.04,52.03 18.16,52.14 18.16,52.67 18.55,53.06 Q1.2 | U2.23 v9,51.51 | U1.29 41.25,13.19 41.75,12.69 U1.30
  Top 0.4: Q1.2 v18.55,55.61
  Top 0.5: 50,10.01 51,11.01
  Top 1.5: P1.32 50,10.01
  Bottom 0.203: 21.5,19.01 21.56,19.01 v21.76,18.82
  Bottom 0.5: v12.7,18.31 13.4,19.01 21.5,19.01
  other vias: 12.7,17.21 12.7,16.01 12.7,14.91 10.2,11.91 51.2,13.31 50,9.01 50.2,13.31 24.06,19.77 50.5,28.01 48,21.51 50.5,21.51 8.5,47.36 8.5,45.86 11,45.86 11,44.36 11.25,23.36 48,18.01 50.5,18.01 12.3,43.31 22.81,18.82 23.06,19.77 22.31,17.82 32.5,8.11 34.25,8.11 32.5,10.11 33.5,10.11 35,10.11 36,10.11 39.4,33.56 48,26.01 50.5,26.01 50,32.51 51,33.51 8.5,44.36 8.2,11.91 8.2,10.91 12.2,21.81 11.25,21.81 16.6,22.94 17,18.01 17,16.51 17,15.01 10.2,10.91 12.2,10.91 50.5,30.51 5.85,52.71 7.1,51.51 8.2,52.71 10.5,52.71 11,51.51 14,52.71 14.25,51.71 21.65,23.69 23.4,22.69 12.1,26.69 32.38,26.61 31,26.61 26.43,26.24 25.68,26.99 26.18,27.99 16.62,35.71 14.03,27.66 12.78,27.66 15.28,27.66 26.18,28.99 35.88,26.11 16.62,34.71 16.62,33.71 16.62,31.71 17.62,31.71 17.62,30.71 18.62,30.71 20.38,40.71 20.38,42.21 30.05,38.11 23.3,52.41 18.75,50.01 17.75,50.01 18.75,49.01 11,47.36 9.75,48.56 14.68,40.16 15.47,39.39 13.68,38.41 10.43,39.16 12.43,39.16 8.93,38.66 8.18,37.41 7.42,33.16 8.43,31.66 11.68,30.16 13.43,30.16 13.43,31.66 13.43,33.16 13.43,34.66 13.43,36.16 8.18,34.66 8.18,36.16 10.07,30.96 10.68,34.66 10.68,32.41 10.68,36.91 22.13,16.69 28.63,19.79 29.81,18.77 30.56,17.77 36.56,16.47 39.88,15.69 40.81,16.47 40.46,17.49 37.12,26.36 46.5,21.51 46.5,17.89 44.98,16.86 44,21.51 48,23.51 46.5,24.51 46.5,26.76 44.5,25.76 44.75,23.01 45.42,14.26 30.51,14.07 32.56,17.77 21.88,40.71 21.88,39.21 21.88,37.71 22.05,36.06 29.81,19.77 31.3,36.61 38.15,33.56 33.55,34.86 31.15,35.31 29.2,34.31 25.25,52.86 26.25,47.51 30.25,50.01 29.25,47.51 29.25,44.51 25.9,45.21 30.05,39.61 47.5,32.01 20.38,43.71 22.8,49.76 28.25,34.31 28.85,51.46 26.6,38.91
  pour Top (rank 6): -2,63.01 56.5,63.01 56.5,6.51 -4,6.51 -4,61.01
  pour Bottom (rank 6): -0.5,62.01 57,62.01 57,-2.49 0,-2.49 0,61.01 -0.5,61.51
  pour Top: 39.85,32.91 39.85,34.11 36.5,34.11 36.5,32.91
  pour Top: 4,50.51 4,53.56 10.55,53.56 10.5,53.51 10.5,50.96 5,50.96 5,50.51
MA20  (via drill 0.35)
  Top 0.2: U3.31 20.94,31.51 v21.6,31.51 | v37.97,28.88 38.55,28.29 38.55,25.27 37.95,24.66 37.95,23.38 37.43,22.86 37.43,22.05 37.11,21.73 37.11,20.76 36.17,19.82 v35.91,19.82 | v33.28,21.52 32.78,21.02 32.25,21.02 31.35,20.11 SW3.S2 31.31,19.9 U6.4
  Top 0.203: 31,20.21 SW3.S2 31.15,19.66 32.05,18.76 32.95,18.76 34.85,16.86 SW3.O1
  Bottom 0.2: v21.6,31.51 21.9,31.21 32.53,31.21 33.41,30.33 36.09,30.33 37.54,28.88 v37.97,28.88 | v33.28,21.52 33.57,21.23 33.57,20.99 34.74,19.82 v35.91,19.82
MA21
  Top 0.2: 31.35,15.91 SW3.S1 | U7.4 29,21.75 29.45,21.75 30.57,20.63
  Top 0.203: 30.57,20.63 30.57,18.94 31.73,17.79 31.73,16.54 SW3.S1
MULTI1  (via drill 0.35)
  Top 0.2: v35.93,15.17 35.63,15.47 35.63,17.08 35.47,17.24 34.97,17.24 33.1,19.11 SW3.P2 33.1,20.36 33.29,20.55 | v46.59,16.55 46.77,16.38 46.77,15.73 46.5,15.46 46.5,13.59 46.75,13.34 U1.40
  Bottom 0.2: v35.93,15.17 36.23,14.87 40.47,14.87 41.76,16.15 45.33,16.15 45.63,16.46 46.5,16.46 v46.59,16.55
MULTI2  (via drill 0.35)
  Top 0.2: v31.09,8.94 30.92,8.94 30.6,9.26 30.6,10.84 32.6,12.84 32.6,14.24 33.1,14.74 SW3.P1 33.1,14.73 v32.81,14.44 | U3.2 8.36,30.9 8.98,30.28 10.41,30.28 11.66,29.04 11.66,27.38 10.57,26.3 10.57,21.56 11.02,21.12 11.68,21.12 12,20.79 12,14.18 11.25,13.43 v11.25,12.03 | v45.91,15.8 46.12,15.58 46.12,13.46 46.25,13.34 U1.39
  Bottom 0.2: v31.09,8.94 30.66,8.94 29.89,8.17 23.11,8.17 20.78,10.5 15.24,10.5 13.4,12.33 11.55,12.33 v11.25,12.03 | v32.81,14.44 33.86,14.44 34.51,15.09 35.08,15.09 35.65,14.51 40.62,14.51 41.91,15.8 v45.9,15.8 v45.91,15.8
N$1
  Top 0.2: SW2.S1 30.45,36.26 30.45,35.02 31.51,33.96 32.49,33.96 U8.4
N$2  (via drill 0.35)
  Top 0.2: R6.2 25.55,48.96 C8.1 25.5,48.61 25.5,48.51 25.18,48.19 25.18,43.73 v25.16,43.71 | v25.74,37.9 25.82,37.82 25.82,35.59 26.5,34.92 26.74,34.92 27.05,34.61 27.59,34.61 27.99,35.01 29.45,35.01 30.33,34.14 30.33,33.14 SW2.S2
  Bottom 0.2: v25.16,43.71 25.56,43.31 25.56,42.01 24.97,41.43 24.97,40.16 25.74,39.39 v25.74,37.9
N$3  (via drill 0.35)
  Top 0.203: R1.2 24.15,53.87 23.15,54.87 v23.15,55.32 | 32,49.01 34,49.01 | U$7.+ 30.69,53.27 30.2,53.76
  Top 0.6: 30.2,53.76 R1.2
  Bottom 0.203: TP3.TP 21.5,55.57 22.9,55.57 v23.15,55.32
  pour Top: 29.95,44.46 arc-90 39.72,54.24 arc-90 49.55,44.41 arc-90 39.77,34.64 arc-90
  pour Top: 30.35,54.26 30.35,51.14 32.15,49.34 33,49.34 34.8,51.14 34.8,52.06 32.6,54.26
N$4  (via drill 0.35)
  Top 0.2: v36.24,27.23 36.24,28.67 35.64,29.27 35.36,29.27 34.59,30.04 33.89,30.04
  Top 0.203: 33.89,30.04 U5.6 33.85,30.04 | 36.24,27.4 v36.24,27.23 | U5.2 31.56,27.46 v31.54,27.44 31.44,27.44 30.4,28.49 29.95,28.49 29.68,28.76 U5.11
  Bottom 0.203: v36.24,27.23 35.87,27.6 32.59,27.6 32.46,27.47 31.57,27.47 v31.54,27.44
N$7  (via drill 0.35)
  Top 0.2: U4.8 13.93,53.51 v13.43,54.01 | R9.2 6.7,52.86 v5.85,53.71 5,54.56 R10.1
  Bottom 0.2: v13.43,54.01 13.12,53.71 v5.85,53.71
N$14  (via drill 0.35)
  Top 0.203: U5.12 28.2,28.19 29.74,28.19 v30.43,27.49 | U5.8 28.23,30.61 30.45,30.61 31.99,29.06 31.99,28.32 v32.18,28.13
  Bottom 0.203: v30.43,27.49 30.51,27.49 31.11,28.1 32.16,28.1 v32.18,28.13
RA14  (via drill 0.35)
  Top 0.2: U2.15 16.65,47.51 17.41,46.75 17.41,46.19 16.94,45.72 16.94,45.02 17.55,44.41 17.55,41.66 17.55,38.08 v17.25,37.78 | v44.28,26.79 44.05,27.03 44.05,27.96 44.44,28.35 44.44,29.47 44.25,29.66 U1.6
  Bottom 0.2: v17.25,37.78 17.29,37.78 17.29,33.39 20.89,29.8 31.94,29.8 32.83,28.92 35.51,28.92 37.26,27.16 43.91,27.16 v44.28,26.79
RA15  (via drill 0.35)
  Top 0.2: U2.16 16.35,48.31 18.25,46.41 18.25,36.93 v17.95,36.63 | v45.38,26.63 44.72,27.28 44.72,27.83 44.9,28.01 44.9,29.51 44.75,29.66 U1.5
  Bottom 0.2: v17.95,36.63 17.95,36.27 17.65,35.97 17.65,33.54 21.03,30.15 32.09,30.15 32.97,29.27 35.65,29.27 37.41,27.51 44.49,27.51 v45.38,26.63
RA16  (via drill 0.35)
  Top 0.2: U2.17 13.8,50.58 14.58,50.58 18.61,46.55 18.61,36 v18.3,35.69 | v45.38,27.56 45.25,27.69 45.25,31.26 45.25,32.01 U1.4
  Bottom 0.2: v18.3,35.69 18.3,35.34 18,35.03 18,33.68 21.18,30.5 32.23,30.5 33.12,29.62 35.8,29.62 37.55,27.87 38.91,27.87 45.07,27.87 v45.38,27.56
RA17  (via drill 0.35)
  Top 0.2: U2.18 13,50.76 13.25,51.01 14.65,51.01 18.96,46.7 18.96,35.06 v18.65,34.76 | v46,28.26 45.75,28.51 U1.3
  Bottom 0.2: v18.65,34.76 18.65,33.53 21.32,30.86 32.38,30.86 33.26,29.97 35.94,29.97 37.69,28.22 39.05,28.22 39.06,28.22 45.96,28.22 v46,28.26
RA18  (via drill 0.35)
  Top 0.2: U2.19 12.2,49 13.19,48.01 13.19,45.66 13.62,45.23 v14.1,45.23 | v46.41,29.76 46.25,29.92 U1.2
  Bottom 0.2: v14.1,45.23 14.1,43.48 19.06,38.52 19.06,37.94 20.02,36.99 20.02,35.82 20.37,35.47 20.37,34.11 20.99,33.48 22.05,33.48 22.91,32.62 30,32.62 30.98,33.59 31.52,33.59 32.04,33.07 33.3,33.07 33.57,32.8 37.2,32.8 38.66,31.34 42.37,31.34 43.94,29.77 46.4,29.77 v46.41,29.76
RA19  (via drill 0.35)
  Top 0.2: U2.20 11.4,49.01 12.82,47.59 12.82,45.52 13.39,44.94 v13.39,44.54 | v46.73,28.88 46.73,29.16 47.06,29.49 47.06,30.03 46.75,30.34 U1.1
  Bottom 0.2: v13.39,44.54 13.74,44.19 13.74,43.34 18.71,38.38 18.71,37.79 19.66,36.84 19.66,35.68 20.02,35.32 20.02,33.96 20.84,33.13 21.9,33.13 22.77,32.27 32.97,32.27 33.23,32 36.87,32 39.3,29.57 43.55,29.57 44.2,28.92 46.69,28.92 v46.73,28.88
RA20  (via drill 0.35)
  Top 0.2: U2.21 10.6,49.01 12.46,47.14 12.46,44.94 v12.49,44.91 | SW3.O2 34.85,19.16 36.2,19.16 37.46,20.42 37.46,21.59 37.78,21.91 37.78,22.71 38.3,23.23 38.3,24.51 38.91,25.12 38.91,28.89 36.59,31.2 v36.59,31.34
  Bottom 0.2: v12.49,44.91 12.74,44.66 12.74,44.27 13.39,43.62 13.39,43.19 18.36,38.23 18.36,37.65 19.31,36.69 19.31,35.53 19.66,35.18 19.66,33.81 20.7,32.78 21.76,32.78 22.62,31.91 32.82,31.91 33.7,31.03 36.28,31.03 v36.59,31.34
RAM_/CS  (via drill 0.35)
  Top 0.2: U2.14 14.55,46.71 14.3,46.96 14.3,49.09 v14.57,49.36 | v12.44,51.31 11.85,51.9 U4.5
  Bottom 0.2: v14.57,49.36 14.57,49.43 12.69,51.31 v12.44,51.31
RAM_/CS_G  (via drill 0.35)
  Top 0.2: U3.22 19.82,19.47 19.28,20.01 19.28,26.55 17.82,28.01 17.82,29.33 15.95,31.2 15.95,36.19 16.87,37.11 17.5,37.11 17.9,37.51 17.9,45.16 17.86,45.16 v17.6,45.42 | U4.6 15.96,52.51 15.96,50.72 19.05,47.63 v19.48,47.63
  Bottom 0.2: v19.48,47.63 19.15,47.96 18.51,47.96 17.41,46.85 17.41,45.61 v17.6,45.42
SND  (via drill 0.35)
  Top 0.2: 48.25,10.89 P1.31 | U1.38 v45.75,10.76
  Top 0.203: R8.2 v48.5,11.01 48.38,11.01 48.25,10.89
  Bottom 0.2: v48.5,11.01 48.2,10.71 45.8,10.71 v45.75,10.76
VBAT  (via drill 0.35)
  Top 0.203: 17.14,54.97 17.2,54.97 v17.49,55.26 | U4.10 16.68,54.51
  Top 0.4: R1.1 22.4,53.76 | R1.1 22.5,53.71 | 22.45,54.12 R1.1 | R1.1 22.33,53.88 v22.33,54.86
  Bottom 0.203: v17.49,55.26 16.75,55.26 TP2.TP
  Bottom 0.4: v17.49,55.26 17.59,55.26 18.15,54.71 22.18,54.71 v22.33,54.86
  pour Top: 15.5,54.41 15.5,55.81 17.85,55.81 17.85,54.41
VCC  (via drill 0.35)
  Top 0.203: 48.29,15.86 R8.1 48.3,15.86 48.3,15.83 v47.52,15.05 | 3,7.51 3,9.01 | 47,33.11 46.5,33.61 | 42.5,33.51 42.45,33.56 42.25,33.56 | 42.25,33.56 41.27,33.56 41.25,33.53 U1.12 | U1.31 U1.10 42.25,33.56
  Top 0.3: U8.1 U8.5 31.57,32.61 v31.25,32.94
  Top 0.4: 27.76,59.95 27.7,60.01 | C1.1 48.5,32.31 47.7,33.11 47,33.11 42.9,33.11 42.5,33.51
  Top 0.5: 3,9.01 2,10.01 | 2,59.01 3,60.01 27.7,60.01 43,60.01 47,56.01 50,56.01 51,55.01 51,44.71
  Top 1.5: P1.1 3,7.51
  Bottom 0.203: v42.18,15.14 47.43,15.14 v47.52,15.05 | TP5.TP v27.5,55.01 | v36.25,21.26 37.5,20.01 41.17,20.01 41.18,20 42.18,20 v42.2,19.99
  Bottom 0.3: v31.25,32.94 31.52,32.67 33.13,32.67 33.4,32.4 37.03,32.4 38.76,30.67 42.05,30.67 v42.05,30.69
  other vias: 34.23,21.26 35.23,21.51 42.2,18.99 45.55,34.66 44.9,35.31 49.15,39.81 49.15,38.81
  pour Top (rank 2): 3.65,2.66 3.65,7.46 6.2,7.46 6.2,13.16 4.7,14.66 4.7,17.96 4.2,18.46 4.2,20.71 5.5,22.01 5.5,47.01 6,47.51 6,48.76 8.25,48.76 8.25,52.91 9.35,54.01 30,54.01 30,52.51 44.15,52.51 44.15,35.61 52.4,35.61 52.4,62.91 52.5,63.01 52.5,63.51 -0.5,63.51 -0.5,2.51 3.5,2.51
  pour Top (rank 2): 41.2,30.61 41.2,35.91 48.45,35.91 48.45,33.01 42.9,33.01 42.9,12.36 41.77,11.24 41.77,30.04
  pour Top: 29.4,22.66 29.4,23.69 38,23.69 38,22.51 37.5,22.01 37.5,21.51 37,21.01 37,20.96 32.77,20.96 32.77,22.66
  pour Bottom: 33.25,22.26 33.25,20.51 35.25,18.51 42.5,18.51 42.5,20.29 41.73,20.29 41.5,20.51 41.25,20.51 41,20.76 37.75,20.76 36.25,22.26
  pour Bottom: 44.23,35.48 45.55,34.16 49.5,38.11 49.5,40.16 48.9,40.16
VCC_SRAM  (via drill 0.35)
  Top 0.203: 21.09,32.17 U3.32 21.31,32.17 21.32,32.18 23.58,32.18 | 33.85,28.74 U5.4 34.75,28.76 35.23,28.29 v35.23,28.26 35.23,27.24 34.8,26.81 U5.1 | 26.85,29.16 26.85,26.91 26.95,26.81 U5.14 | 26.85,29.16 27.1,29.41 U5.10 29.96,29.41 v30.23,29.14 | 26.85,29.16 26.85,30.46 25.7,31.61 24.15,31.61 23.58,32.18 | 23.25,30.71 C6.1 C5.1 | U4.1 11.85,55.28 v12.2,55.64 | R5.1 22.12,51.03 | 23.58,32.18 23.25,32.51 23.25,42.26 21.65,43.86 | U3.30 22.3,29.63
  Bottom 0.203: v35.23,28.26 35.21,28.25 32.99,28.25 31.82,29.43 30.5,29.43 30.5,29.42 v30.23,29.14 | v14.7,55.64 16.25,54.09 16.25,52.76 16.98,52.03 v20.62,52.03
  other vias: 13.45,55.64 21.62,52.03 20.43,51.03 14.07,54.76
  pour Top: 11.85,54.51 11.85,56.09 15.05,56.09 15.05,53.56 13.85,53.56 12.9,54.51
  pour Top: 19.5,52.39 19.5,45.76 21.25,45.76 21.25,43.09 22.75,41.59 22.75,32.26 19.75,32.26 19.75,28.01 24,28.01 24,31.26 25.75,31.26 26.82,30.19 26.82,26.81 29,26.81 29,31.26 28.25,32.01 26.2,32.01 26.2,38.36 24.25,38.36 24.25,45.76 23.95,45.76 23.95,48.96 22.07,48.96 22.07,52.39
  pour Bottom: 16,56.09 16,55.26 16.85,55.26 16.85,53.16 20.5,53.16 20.5,52.39 22.07,52.39 22.07,50.73 16.4,50.73 14.85,52.28 14.85,54.01 13.25,54.01 13,53.76 10.93,53.76 10.93,56.09

### Text on the board
tPlace: SW2B | ON | SW2A | SW3A | ON | SW3B
tNames: + | MBC5 | CR2025 | SW1 | CR2016 | - | EEPROM | SRAM | 29F032 / 29F033 | 1008 / 62256 / 6264
tStop: GAME BOY MBC5 MULTICART | 1 | 32
bStop: v1.3 | www.mousebitelabs.com | SUPPORT ORIGINAL CREATORS!